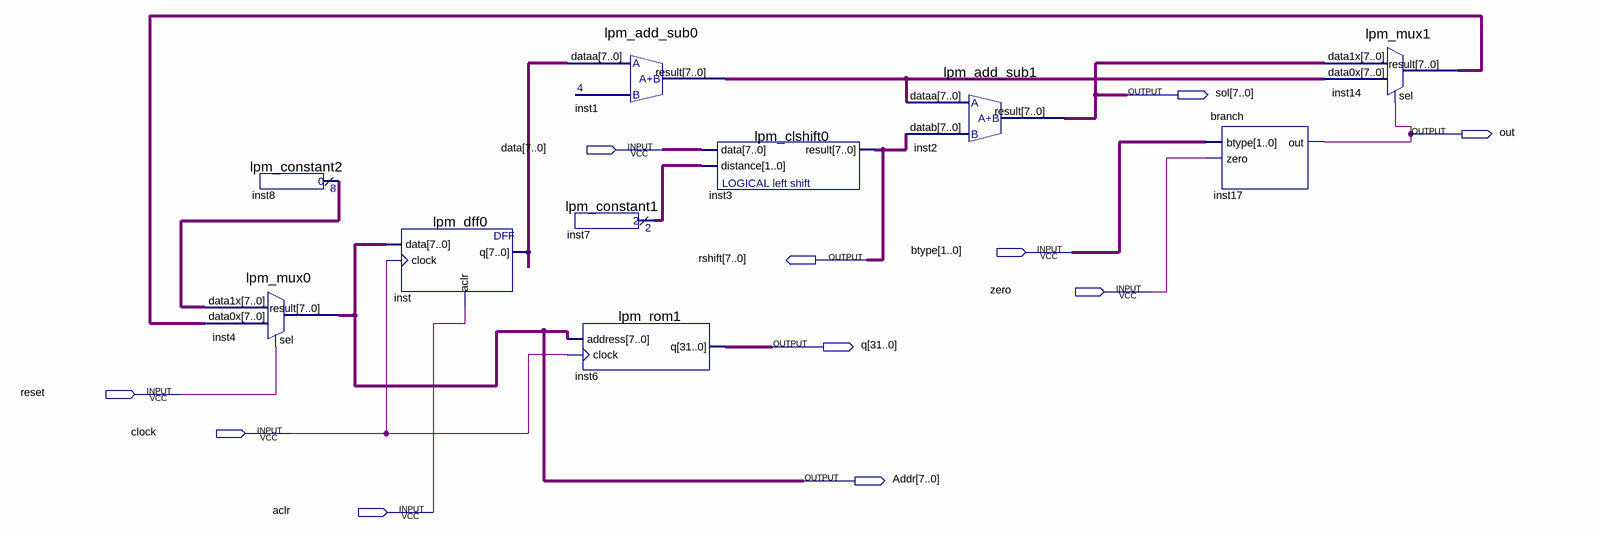
[diagram p0: schematic sheet]
// Quartus schematic fetch.bdf as structural Verilog: 10 symbols, 11 pins
module fetch (
  input  [7:0] data,
  input  [1:0] btype,
  input  zero,
  input  reset,
  input  clock,
  input  aclr,
  output [7:0] sol,
  output out,
  output [7:0] rshift,
  output [31:0] q,
  output [7:0] Addr
);

  wire [1:0] inst7_result;
  wire [7:0] inst1_result, inst8_result, inst14_result, inst_q;

  lpm_mux0 inst4 (.data1x(inst8_result), .data0x(inst14_result), .sel(reset), .result(Addr));
  lpm_constant2 inst8 (.result(inst8_result));
  lpm_dff0 inst (.data(Addr), .clock(clock), .aclr(aclr), .q(inst_q));
  lpm_add_sub0 inst1 (.dataa(inst_q), .result(inst1_result));
  lpm_constant1 inst7 (.result(inst7_result));
  lpm_rom1 inst6 (.address(Addr), .clock(clock), .q(q));
  lpm_clshift0 inst3 (.data(data), .distance(inst7_result), .result(rshift));
  lpm_add_sub1 inst2 (.dataa(inst1_result), .datab(rshift), .result(sol));
  branch inst17 (.btype(btype), .zero(zero), .out(out));
  lpm_mux1 inst14 (.data1x(sol), .data0x(inst1_result), .sel(out), .result(inst14_result));
endmodule
